# Altium schematic sheet MCU.SchDoc
size A3
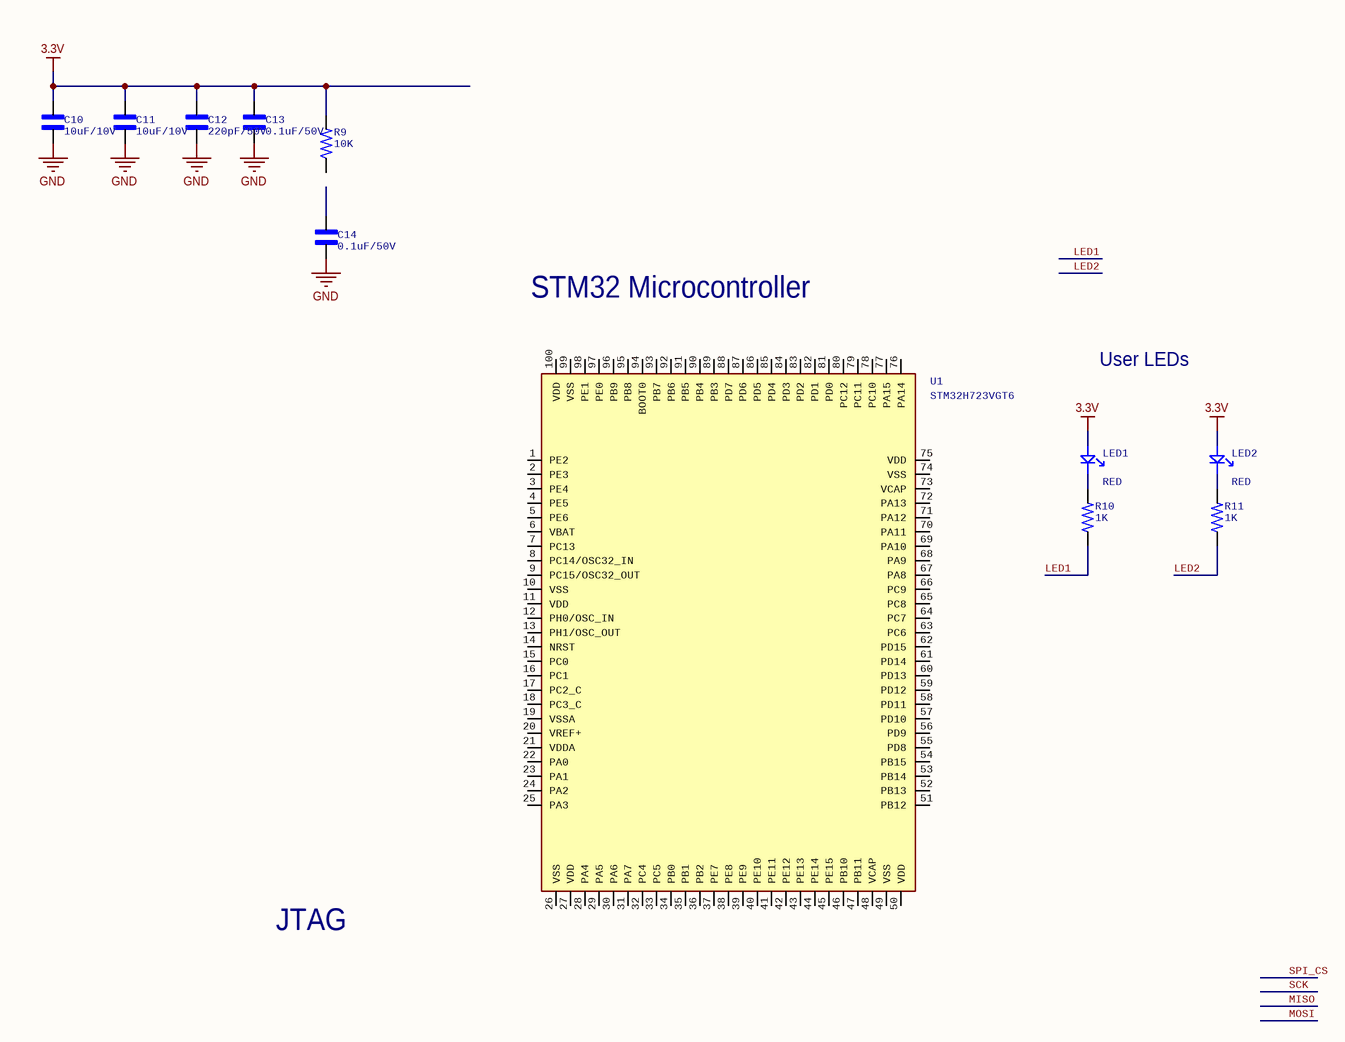
[diagram p0: MCU.SchDoc]

## Parts
C10  10uF/10V  [C0603]
C11  10uF/10V  [C0603]
C12  220pF/50V  [C0603]
C13  0.1uF/50V  [C0603]
C14  0.1uF/50V  [C0603]
LED1  RED  [LED 0603]
LED2  RED  [LED 0603]
R9  10K  [R0603]
R10  1K  [R0603]
R11  1K  [R0603]
U1  STM32H723VGT6  [QFP-100]

## Nets
3.3V: C10.1 C11.1 C12.1 C13.1 LED1.1(A) LED2.1(A) R9.2
GND: C10.2 C11.2 C12.2 C13.2 C14.2
LED1: R10.1
LED2: R11.1
NetLED1_2: LED1.2(K) R10.2
NetLED2_2: LED2.2(K) R11.2

Not connected (* = marked no-connect by the designer): C14 1; R9 1; U1 1(PE2) 2(PE3) 3(PE4) 4(PE5) 5(PE6) 6(VBAT) 7(PC13) 8(PC14/OSC32_IN) 9(PC15/OSC32_OUT) 10(VSS) 11(VDD) 12(PH0/OSC_IN) 13(PH1/OSC_OUT) 14(NRST) 15(PC0) 16(PC1) 17(PC2_C) 18(PC3_C) 19(VSSA) 20(VREF+) 21(VDDA) 22(PA0) 23(PA1) 24(PA2) 25(PA3) 26(VSS) 27(VDD) 28(PA4) 29(PA5) 30(PA6) 31(PA7) 32(PC4) 33(PC5) 34(PB0) 35(PB1) 36(PB2) 37(PE7) 38(PE8) 39(PE9) 40(PE10) 41(PE11) 42(PE12) 43(PE13) 44(PE14) 45(PE15) 46(PB10) 47(PB11) 48(VCAP) 49(VSS) 50(VDD) 51(PB12) 52(PB13) 53(PB14) 54(PB15) 55(PD8) 56(PD9) 57(PD10) 58(PD11) 59(PD12) 60(PD13) 61(PD14) 62(PD15) 63(PC6) 64(PC7) 65(PC8) 66(PC9) 67(PA8) 68(PA9) 69(PA10) 70(PA11) 71(PA12) 72(PA13) 73(VCAP) 74(VSS) 75(VDD) 76(PA14) 77(PA15) 78(PC10) 79(PC11) 80(PC12) 81(PD0) 82(PD1) 83(PD2) 84(PD3) 85(PD4) 86(PD5) 87(PD6) 88(PD7) 89(PB3) 90(PB4) 91(PB5) 92(PB6) 93(PB7) 94(BOOT0) 95(PB8) 96(PB9) 97(PE0) 98(PE1) 99(VSS) 100(VDD)

## Notes on the sheet
- STM32 Microcontroller
- User LEDs
- JTAG

## Library data of the parts
C10 C11 = C0603 10uF/10V: MLCC 10uF 10V X5R 20% 0603; Manufacturer: KEMET; Manufacturer Part Number: C0603C106M8PAC7867; Supplier 1: Mouser; Supplier Part Number 1: 80-C0603C106M8PACTU; RoHS: Yes; Category: Ceramic Capacitors; Stock 1: 19357; Pricing 1: 1=0.46000, 10=0.24500, 50=0.24500, 100=0.21300, 1000=0.13400, 10000=0.10600 (USD); Supplier 2: Digi-Key; Supplier Part Number 2: 399-14945-6-ND; Mount: Surface Mount; Case/Package: 0603; Case Code (Imperial): 0603; Case Code (Metric): 1608; Min Operating Temperature: -55°C; Max Operating Temperature: 85°C; Packaging: Cut Tape; Capacitance: 10uF; Tolerance: 20%; Voltage Rating: 10V; RoHS Compliant: Yes
C12 = C0603 220pF/50V: MLCC 220pF 50V X7R 10% 0603; Manufacturer: KEMET; Manufacturer Part Number: C0603C221K5RACTU; Dielectric Material: Ceramic; Supplier 1: Mouser; Supplier Part Number 1: 80-C0603C221K5R; RoHS: Yes; Category: Ceramic Capacitors; Stock 1: 91306; Pricing 1: 1=0.10000, 10=0.03100, 100=0.02100, 500=0.01800, 1000=0.01400, 4000=0.01100 (USD); Mount: Surface Mount; Case/Package: 0603; Min Operating Temperature: -55°C; Max Operating Temperature: 125°C; Packaging: Tape and Reel; Tolerance: 10%; Capacitance: 220pF; Dielectric: X7R; Termination: SMD/SMT; Voltage Rating (DC): 50V; Voltage: 50V; Length: 1.6mm; Height: 0.8mm; Depth: 0.8mm; Radiation Hardening: No
C13 C14 = C0603 0.1uF/50V: MLCC 0.1uF 50V X5R 10% 0603; Manufacturer: TDK; Manufacturer Part Number: C1608X5R1H104K080AA; Dielectric Material: Ceramic; Capacitance: 100nF; Supplier 1: Mouser; Supplier Part Number 1: 810-C1608X5R1H104K; RoHS: Yes; Category: Ceramic Capacitors; Stock 1: 520600; Pricing 1: 1=0.12000, 10=0.04500, 100=0.03700, 500=0.02600, 1000=0.02100, 4000=0.01800 (USD); Mount: Surface Mount; Case/Package: 0603; Number of Pins: 2; Case Code (Metric): 1608; Case Code (Imperial): 0603; Weight: 7.1E-05oz; Min Operating Temperature: -55°C; Max Operating Temperature: 85°C; Tolerance: 10%; Dielectric: X5R; Voltage Rating: 50V; Packaging: Tape and Reel; Voltage Rating (DC): 50V; Termination: SMD/SMT; Package Quantity: 1; Resistor Type: Ceramic; Length: 1.6mm; Width: 0.031inch; Height: 0.8mm; Depth: 0.8mm; Thickness: 0.035inch; Radiation Hardening: No; REACH SVHC: No SVHC; Lead Free: Lead Free; Supplier 2: Mouser; Supplier Part Number 2: 187-CL10B104KB8NNNC
LED1 LED2 = LED 0603 RED: Red 625nm LED Indication - Discrete 2V 0603; Manufacturer: Wurth Electronics; Manufacturer Part Number: 150060RS55040; Lens Style: Flat; Lens Transparency: Diffused; Luminous Intensity: 90mcd; Test Current: 20mA; Viewing Angle: 140°; Dominant Wavelength: 624nm; Lens Size: 0.8mm; Supplier 1: Mouser; Supplier Part Number 1: 710-150060RS55040; RoHS: No; Category: LEDs; Stock 1: 8586; Pricing 1: 1=0.18000, 10=0.16200, 100=0.14700, 500=0.13200, 1000=0.11700, 2000=0.11700 (USD); Mount: Surface Mount; Case/Package: 0603; Color: Red; Case Code (Imperial): 0603; Case Code (Metric): 1608; Packaging: Tape and Reel; Forward Voltage: 2V; Length: 1.6mm; Height: 0.5mm; Width: 0.8mm
R9 = R0603 10K: RES 0603 10K OHM 1% 1/10W; Manufacturer: Yageo; Manufacturer Part Number: RC0603FR-0710KP; Resistance: 10kR; Max Power Dissipation: 100mW; Temperature Coefficient: 150ppm/°C; Supplier 1: Mouser; Supplier Part Number 1: 603-RC0603FR-0710KP; RoHS: Yes; Category: Chip SMD Resistors; Stock 1: 6316; Pricing 1: 1=0.18000, 10=0.04200, 50=0.04200, 100=0.01400, 1000=0.01000, 10000=0.00600 (USD); Case/Package: 0603; Case Code (Metric): 1608; Case Code (Imperial): 0603; Min Operating Temperature: -55°C; Max Operating Temperature: 155°C; Packaging: Tape and Reel; Tolerance: 1%; Resistor Type: Thick Film; Number of Terminations: 2; Features: Moisture Resistant; Length: 0.063inch; Width: 0.031inch; Height: 0.022inch; RoHS Compliant: Yes
R10 R11 = R0603 1K: RES 0603 1K OHM 1% 1/10W; Manufacturer: Yageo; Manufacturer Part Number: RC0603FR-071KL; Resistance: 1kR; Temperature Coefficient: 100ppm/°C; Power Rating: 100mW; Voltage Rating: 50V; Supplier 1: Mouser; Supplier Part Number 1: 603-RC0603FR-071KL; RoHS: Yes; Category: Chip SMD Resistors; Stock 1: 1697496; Pricing 1: 1=0.10000, 10=0.02100, 50=0.02100, 100=0.00700, 1000=0.00400, 10000=0.00200 (USD); Case/Package: 0603; Contact Plating: Tin,Matte; Case Code (Imperial): 0603; Case Code (Metric): 1608; Size Code: 0603; Min Operating Temperature: -55°C; Max Operating Temperature: 155°C; Tolerance: 1%; Resistor Type: Thick Film; Packaging: Tape and Reel; Termination: SMD/SMT; Features: Moisture Resistant; Series: RC; Max Power Dissipation: 100mW; Number of Terminations: 2; Technology: THICK FILM; Resistance Tolerance: 1%; Construction: Rectangular; Length: 1.6mm; Height: 0.45mm; Depth: 0.8mm; Radiation Hardening: No; REACH SVHC: No SVHC; Military Standard: Not; Lead Free: Lead Free; RoHS Compliant: Yes
U1 = STM32H723VGT6: MCU 32-bit ARM Cortex M7 RISC 1MB Flash 1.8V/2.5V/3.3V 100-Pin LQFP Tray; Manufacturer: STMicroelectronics; Supplier 1: Mouser; Manufacturer Part Number: STM32H723VGT6; RoHS: Yes; Category: Microcontrollers; Stock 1: 2663; Pricing 1: 1=12.88, 10=11.84, 50=10.07, 100=10, 1000=8.84, 10000=8.84 (USD); Supplier Part Number 1: 511-STM32H723VGT6